# Altium schematic sheet DSO_Top.SchDoc: Schematic_Name
size A4; CompanyName: University of Melbourne; Engineer: Your Name Here; DocumentNumber: 1; Revision: 0.1; SheetNumber: 1; SheetTotal: 1; Title_Project: Project_Title; StudentNo: Student No.
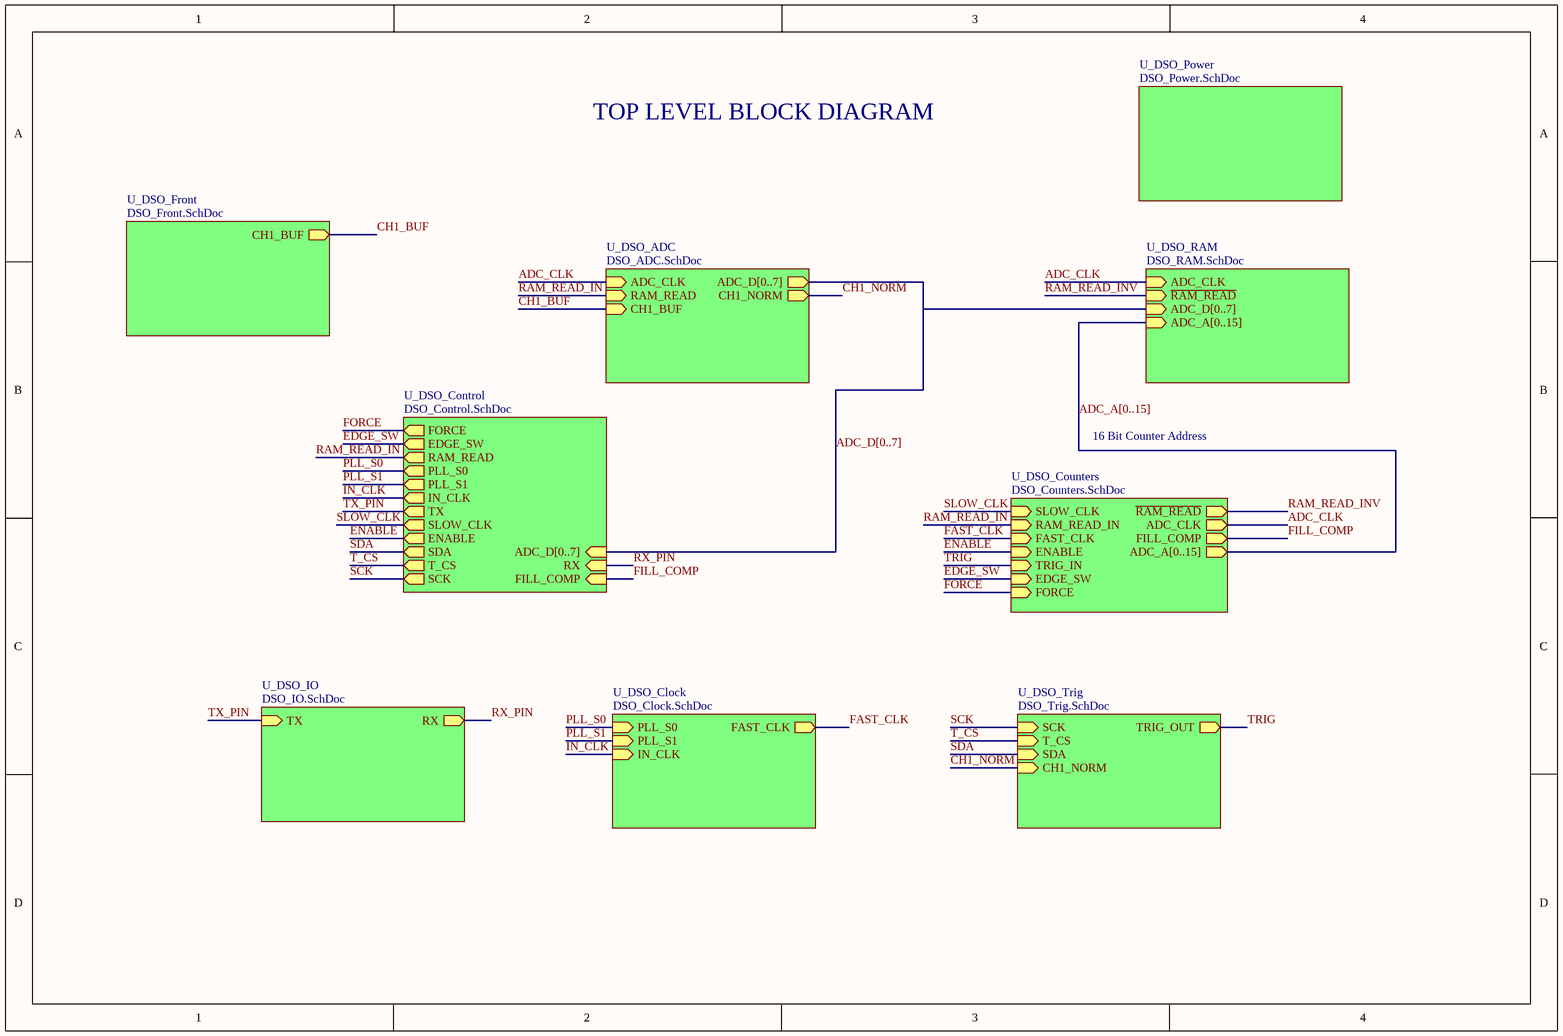
[diagram p0: DSO_Top.SchDoc]

## Sub-sheets
U_DSO_ADC = DSO_ADC.SchDoc: ADC_CLK (in), ADC_D[0..7] (out), RAM_READ (in), CH1_BUF (in), CH1_NORM (out)
U_DSO_Clock = DSO_Clock.SchDoc: FAST_CLK (out), PLL_S0 (in), PLL_S1 (in), IN_CLK (in)
U_DSO_Control = DSO_Control.SchDoc: SCK (out), T_CS (out), SDA (out), ENABLE (out), FILL_COMP (in), SLOW_CLK (out), TX (out), RX (in), IN_CLK (out), PLL_S1 (out), PLL_S0 (out), RAM_READ (out), ADC_D[0..7] (in), EDGE_SW (out), FORCE (out)
U_DSO_Counters = DSO_Counters.SchDoc: SLOW_CLK (in), ~{RAM_READ} (out), ADC_CLK (out), RAM_READ_IN (in), FAST_CLK (in), FILL_COMP (out), ENABLE (in), TRIG_IN (in), EDGE_SW (in), FORCE (in), ADC_A[0..15] (out)
U_DSO_Front = DSO_Front.SchDoc: CH1_BUF (out)
U_DSO_IO = DSO_IO.SchDoc: TX (in), RX (out)
U_DSO_Power = DSO_Power.SchDoc: no entries
U_DSO_RAM = DSO_RAM.SchDoc: ADC_CLK (in), ~{RAM_READ} (in), ADC_D[0..7] (in), ADC_A[0..15] (in)
U_DSO_Trig = DSO_Trig.SchDoc: TRIG_OUT (out), SCK (in), T_CS (in), SDA (in), CH1_NORM (in)

## Nets
ADC_CLK: sheet U_DSO_ADC/ADC_CLK, sheet U_DSO_Counters/ADC_CLK, sheet U_DSO_RAM/ADC_CLK
CH1_BUF: sheet U_DSO_ADC/CH1_BUF, sheet U_DSO_Front/CH1_BUF
CH1_NORM: sheet U_DSO_ADC/CH1_NORM, sheet U_DSO_Trig/CH1_NORM
EDGE_SW: sheet U_DSO_Control/EDGE_SW, sheet U_DSO_Counters/EDGE_SW
ENABLE: sheet U_DSO_Control/ENABLE, sheet U_DSO_Counters/ENABLE
FAST_CLK: sheet U_DSO_Clock/FAST_CLK, sheet U_DSO_Counters/FAST_CLK
FILL_COMP: sheet U_DSO_Control/FILL_COMP, sheet U_DSO_Counters/FILL_COMP
FORCE: sheet U_DSO_Control/FORCE, sheet U_DSO_Counters/FORCE
IN_CLK: sheet U_DSO_Clock/IN_CLK, sheet U_DSO_Control/IN_CLK
PLL_S0: sheet U_DSO_Clock/PLL_S0, sheet U_DSO_Control/PLL_S0
PLL_S1: sheet U_DSO_Clock/PLL_S1, sheet U_DSO_Control/PLL_S1
RAM_READ_IN: sheet U_DSO_ADC/RAM_READ, sheet U_DSO_Control/RAM_READ, sheet U_DSO_Counters/RAM_READ_IN
RAM_READ_INV: sheet U_DSO_Counters/~{RAM_READ}, sheet U_DSO_RAM/~{RAM_READ}
RX_PIN: sheet U_DSO_Control/RX, sheet U_DSO_IO/RX
SCK: sheet U_DSO_Control/SCK, sheet U_DSO_Trig/SCK
SDA: sheet U_DSO_Control/SDA, sheet U_DSO_Trig/SDA
SLOW_CLK: sheet U_DSO_Control/SLOW_CLK, sheet U_DSO_Counters/SLOW_CLK
T_CS: sheet U_DSO_Control/T_CS, sheet U_DSO_Trig/T_CS
TRIG: sheet U_DSO_Counters/TRIG_IN, sheet U_DSO_Trig/TRIG_OUT
TX_PIN: sheet U_DSO_Control/TX, sheet U_DSO_IO/TX

## Buses and harness runs
bus ADC_A[0..15] = sheet U_DSO_Counters/ADC_A[0..15] = sheet U_DSO_RAM/ADC_A[0..15]
bus ADC_D[0..7] = sheet U_DSO_ADC/ADC_D[0..7] = sheet U_DSO_Control/ADC_D[0..7] = sheet U_DSO_RAM/ADC_D[0..7]

## Notes on the sheet
- TOP LEVEL BLOCK DIAGRAM
- 16 Bit Counter Address